# EasyEDA Pro project FSS1500-HANDold.eprj

# Schematic Schematic1
Create Date: 2022-12-30; Page Name: P1; Project Name: FSS1500-HAND; Schematic Name: Schematic1; Update Date: 2022-12-30
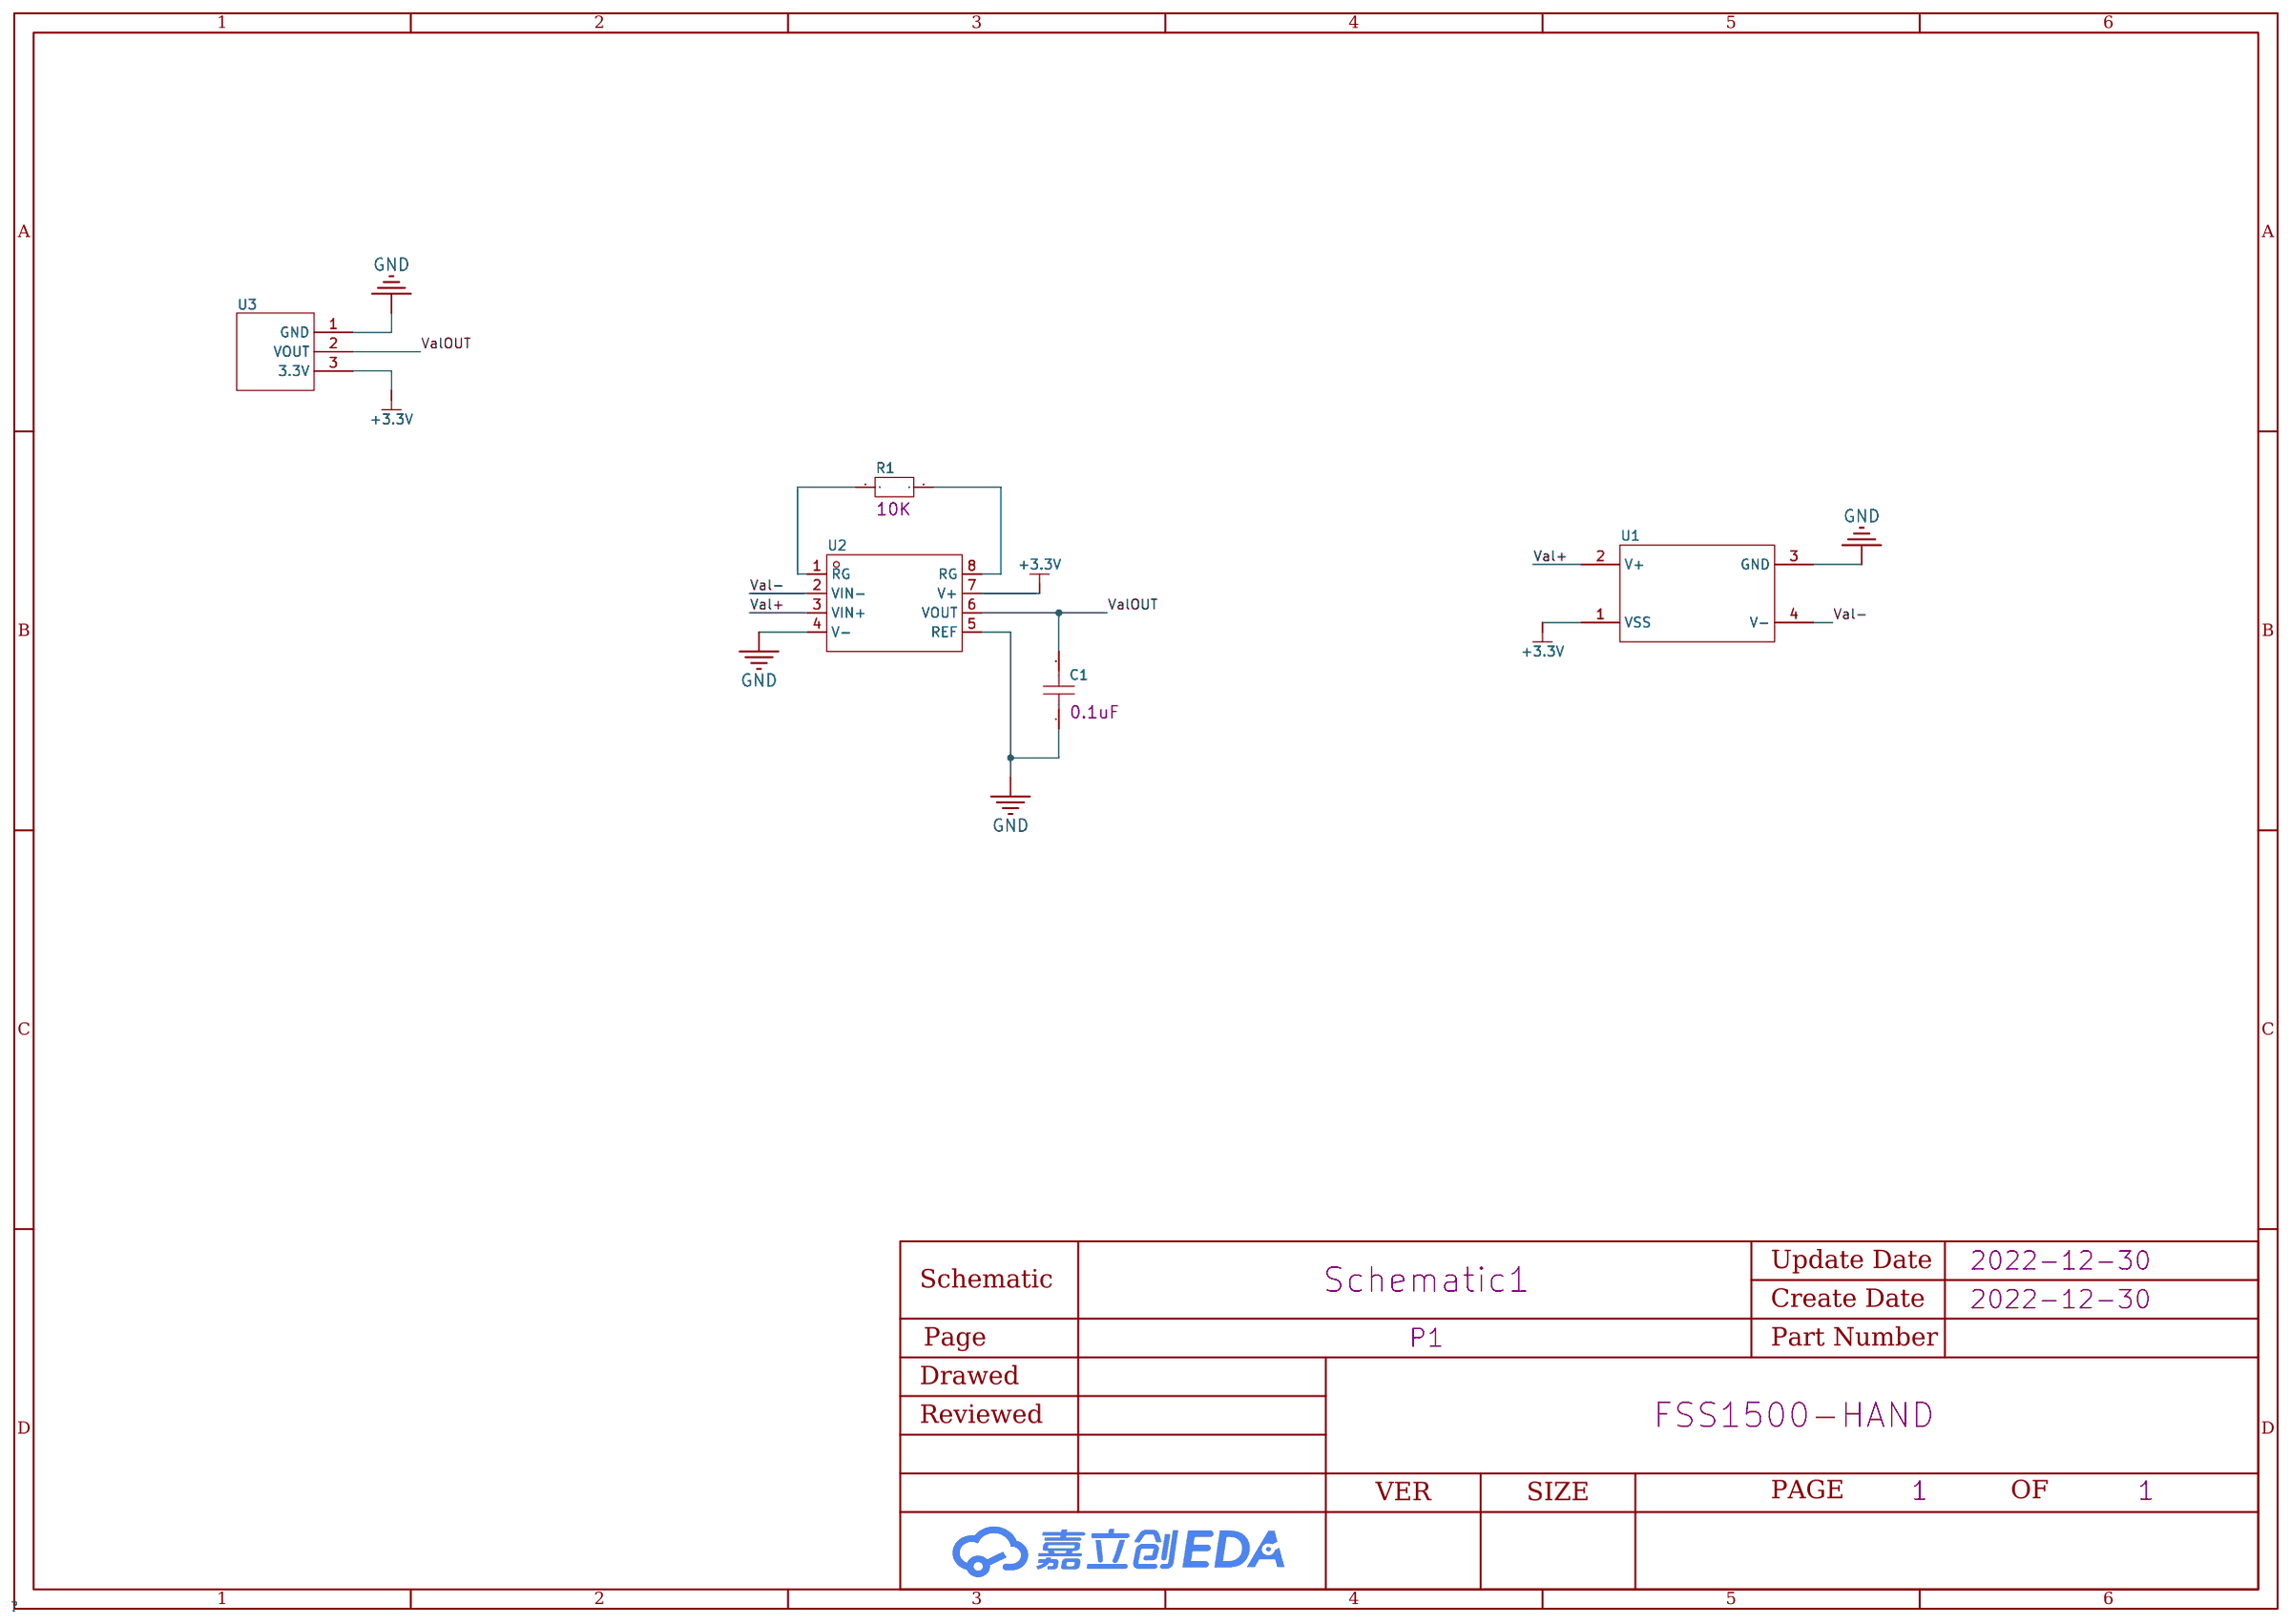
[diagram p0: schematic sheet]

## Parts
C1  -  [0603]
R1  -  [0603]
U1  -  [FSS1500]
U2  INA333AIDGKR  [MSOP-8_L3.0-W3.0-P0.65-LS5.0-BL]
U3  -  [3POINT]

## Library data of the parts
C1 = 电容: 0603 标准贴片电容; Capacitance: 0.1uF
R1 = 电阻: 0603 标准贴片电阻; Resistance: 10K
U1 = FSS1500
U2 = INA333AIDGKR: 运放类型:Instrumentation;放大器组数:1;增益带宽积（GBP）:-;压摆率（SR）:0.16 V/us;电源电压:1.8V ~ 5.5V, ±0.9V ~ 2.75V;各通道供电电流:75uA;; Supplier Part: C19450; Manufacturer: TI(德州仪器); Supplier Footprint: VSSOP-8; JLCPCB Part Class: Extended Part; Datasheet: https://atta.szlcsc.com/upload/public/pdf/source/20130925/1457706651096.pdf; Supplier: LCSC; Amplifier Type: Instrumentation; Number of Circuits: 1; Slew Rate（SR）: 0.16 V/us; Output Type: Rail-to-Rail; Supply Voltage（Single）: 1.8V ~ 5.5V, ±0.9V ~ 2.75V; Iq per channel (Typ): 75uA; Operating Temperature: -40°C ~ 125°C
U3 = 3POINT

## Nets
+3.3V: U1.1(VSS) U2.7(V+) U3.3(3.3V)
GND: C1.1 U1.3(GND) U2.4(V-) U2.5(REF) U3.1(GND)
Val+: U1.2(V+) U2.3(VIN+)
Val-: U1.4(V-) U2.2(VIN-)
ValOUT: C1.2 U2.6(VOUT) U3.2(VOUT)
$1N427: R1.1 U2.1(RG)
$1N434: R1.2 U2.8(RG)

# Board PCB1
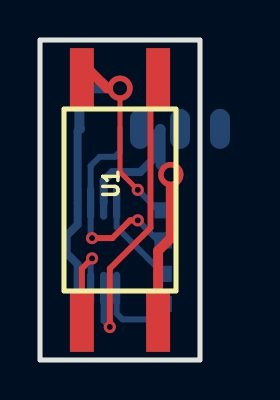
[diagram p1: board, top side]
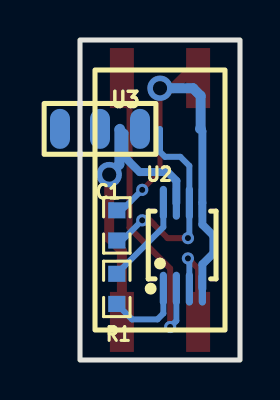
[diagram p2: board, bottom side, seen from below]

Outline 8 x 16 mm; copper layers: Top Layer, Bottom Layer. Coordinates in mm from the lower left corner of the outline.
Outline path: rectangle 0,16 8,0
Stack: Top Layer 0.035mm / Dielectric1 1.51mm FR4 er 4.5 / Bottom Layer 0.035mm

## Design rules (mm)
spacing safeClearance (default): track to track 0.152, other pairs 0.152 to 0.3
track width trackWidth (default): min 0.127, default 0.254, max 2.54
differential pair differentialPair (default): width min 0.127, default 0.254, max 2.54; gap min 0.152, default 0.152
via viaSize (default): diameter min 0.5, default 0.61, max 10; hole min 0.3, default 0.305, max 6

## Placement (name value [footprint] x y rotation side)
C1  -  [0603]  6.16 6.73 270 bottom
R1  -  [0603]  6.16 3.56 90 bottom
U1  -  [FSS1500]  4 8 90 top
U2  INA333AIDGKR  [MSOP-8_L3.0-W3.0-P0.65-LS5.0-BL]  2.86 5.71 180 bottom
U3  -  [3POINT]  4 11.56 0 bottom

## Footprints (pads in the part's own frame, mm; a bottom-side part is the same pattern mirrored in y, then rotated)
3POINT
  oval 1x2 smd: 1(1,0) 2(3,0) 3(5,0)
0603
  rect 0.806x0.864 smd: 1(-0.753,0) 2(0.753,0)
FSS1500
  rect 3x1.2 smd: 1(-6.096,-1.905) 2(-6.096,1.905) 3(6.096,1.905) 4(6.096,-1.905)
MSOP-8_L3.0-W3.0-P0.65-LS5.0-BL
  oval 0.363x1.692 smd: 1(-0.976,-2.147) 2(-0.325,-2.147) 3(0.325,-2.147) 4(0.976,-2.147) 5(0.976,2.147) 6(0.325,2.147) 7(-0.325,2.147) 8(-0.976,2.147)

## Nets
+3.3V: U1.1 U2.7 U3.3
GND: C1.1 U1.3 U2.4 U2.5 U3.1
VAL+: U1.2 U2.3
VAL-: U1.4 U2.2
VALOUT: C1.2 U2.6 U3.2
$1N427: R1.1 U2.1
$1N434: R1.2 U2.8

## Via types
v1: diameter 0.61, hole 0.305, Top Layer to Bottom Layer, 5 vias
v2: diameter 1.27, hole 0.711, Top Layer to Bottom Layer, 2 vias

## Routing (per net, layer and track width the routed paths; a pad name or vN(x,y) marks a point on that pad's centre or on a via; arc(x,y) is an arc through that point)
+3.3V: length 15.8
  Top Layer w0.5: v2(6.54,9.27) 6.54,6.09 5.91,5.46 U1.1
  Bottom Layer w0.4: 6,11.56 5.78,11.33 5.78,10.16 5.02,9.4 3.62,9.4 3.18,8.96 U2.7
  Bottom Layer w0.5: v2(6.54,9.27) 6.03,9.78 6.03,11.52 6,11.56
GND: length 21.9
  Top Layer w0.254: v2(4,13.59) 4,9.4 v1(4.89,8.51)
  Top Layer w0.5: U1.3 2.48,14.48 3.37,13.59 v2(4,13.59)
  Bottom Layer w0.3: C1.1 5.91,7.48 v1(4.89,8.51)
  Bottom Layer w0.4: 2,11.56 1.88,11.44 U2.5 1.88,6.77 1.33,6.22 1.33,5.33 1.88,4.78 U2.4
  Bottom Layer w0.5: v2(4,13.59) 2.35,13.59 1.97,13.21 1.97,11.59 2,11.56
VAL+: length 4.9
  Top Layer w0.3: U1.2 2.09,4.57 v1(2.6,5.08)
  Bottom Layer w0.3: v1(2.6,5.08) 2.53,5.01 U2.3
VAL-: length 15.5
  Top Layer w0.3: v1(3.49,1.65) 3.49,4.57 5.52,6.6 5.52,13.72 U1.4
  Bottom Layer w0.3: v1(3.49,1.65) 3.18,1.96 U2.2
VALOUT: length 10.9
  Top Layer w0.3: v1(4.89,6.98) 4.51,6.98 3.62,6.09 v1(2.6,6.09)
  Bottom Layer w0.3: 4,11.56 4,10.41 3.75,10.16 2.98,10.16 2.53,9.71 U2.6 2.53,6.17 v1(2.6,6.09) ; v1(4.89,6.98) 5.9,5.98 C1.2
$1N427: length 3.8
  Bottom Layer w0.3: U2.1 3.83,2.33 4.13,2.03 5.4,2.03 6.03,2.67
$1N434: length 4.5
  Bottom Layer w0.3: R1.2 6.16,4.32 3.83,6.64 U2.8
